# Altium schematic sheet Ring 2_A.SchDoc
size A; SheetNumber: 11; SheetTotal: 30
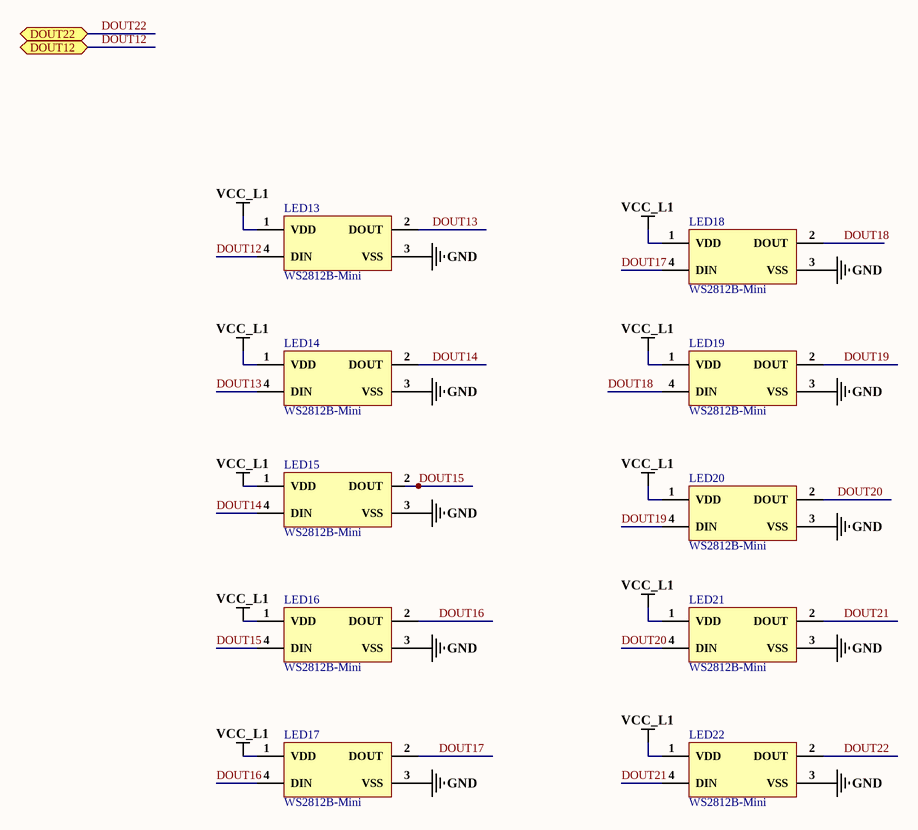
[diagram p0: Ring 2_A.SchDoc]

## Parts
LED13  WS2812B-Mini  [WS2812B-Mini]
LED14  WS2812B-Mini  [WS2812B-Mini]
LED15  WS2812B-Mini  [WS2812B-Mini]
LED16  WS2812B-Mini  [WS2812B-Mini]
LED17  WS2812B-Mini  [WS2812B-Mini]
LED18  WS2812B-Mini  [WS2812B-Mini]
LED19  WS2812B-Mini  [WS2812B-Mini]
LED20  WS2812B-Mini  [WS2812B-Mini]
LED21  WS2812B-Mini  [WS2812B-Mini]
LED22  WS2812B-Mini  [WS2812B-Mini]

## Ports
DOUT12 (bidir), DOUT22 (bidir)

## Nets
GND: LED13.3(VSS) LED14.3(VSS) LED15.3(VSS) LED16.3(VSS) LED17.3(VSS) LED18.3(VSS) LED19.3(VSS) LED20.3(VSS) LED21.3(VSS) LED22.3(VSS)
VCC_L1: LED13.1(VDD) LED14.1(VDD) LED15.1(VDD) LED16.1(VDD) LED17.1(VDD) LED18.1(VDD) LED19.1(VDD) LED20.1(VDD) LED21.1(VDD) LED22.1(VDD)
DOUT12: LED13.4(DIN) ; port DOUT12
DOUT13: LED13.2(DOUT) LED14.4(DIN)
DOUT14: LED14.2(DOUT) LED15.4(DIN)
DOUT15: LED15.2(DOUT) LED16.4(DIN)
DOUT16: LED16.2(DOUT) LED17.4(DIN)
DOUT17: LED17.2(DOUT) LED18.4(DIN)
DOUT18: LED18.2(DOUT) LED19.4(DIN)
DOUT19: LED19.2(DOUT) LED20.4(DIN)
DOUT20: LED20.2(DOUT) LED21.4(DIN)
DOUT21: LED21.2(DOUT) LED22.4(DIN)
DOUT22: LED22.2(DOUT) ; port DOUT22

## Library data of the parts
LED13-LED22 = WS2812B-Mini: SMD,3.5x3.5mm Light Emitting Diodes (LED) RoHS; Manufacturer: Worldsemi; ComponentLink1Description: LCSC; ComponentLink1URL: *https://lcsc.com/product-detail/Light-Emitting-Diodes-LED_Worldsemi-WS2812B-Mini_C527089.html; Package: SMD,3.5x3.5mm; Parameter 1: *